# Altium project ТЕИЯ.464511.002 main.PrjPcb (part 1 of 3)
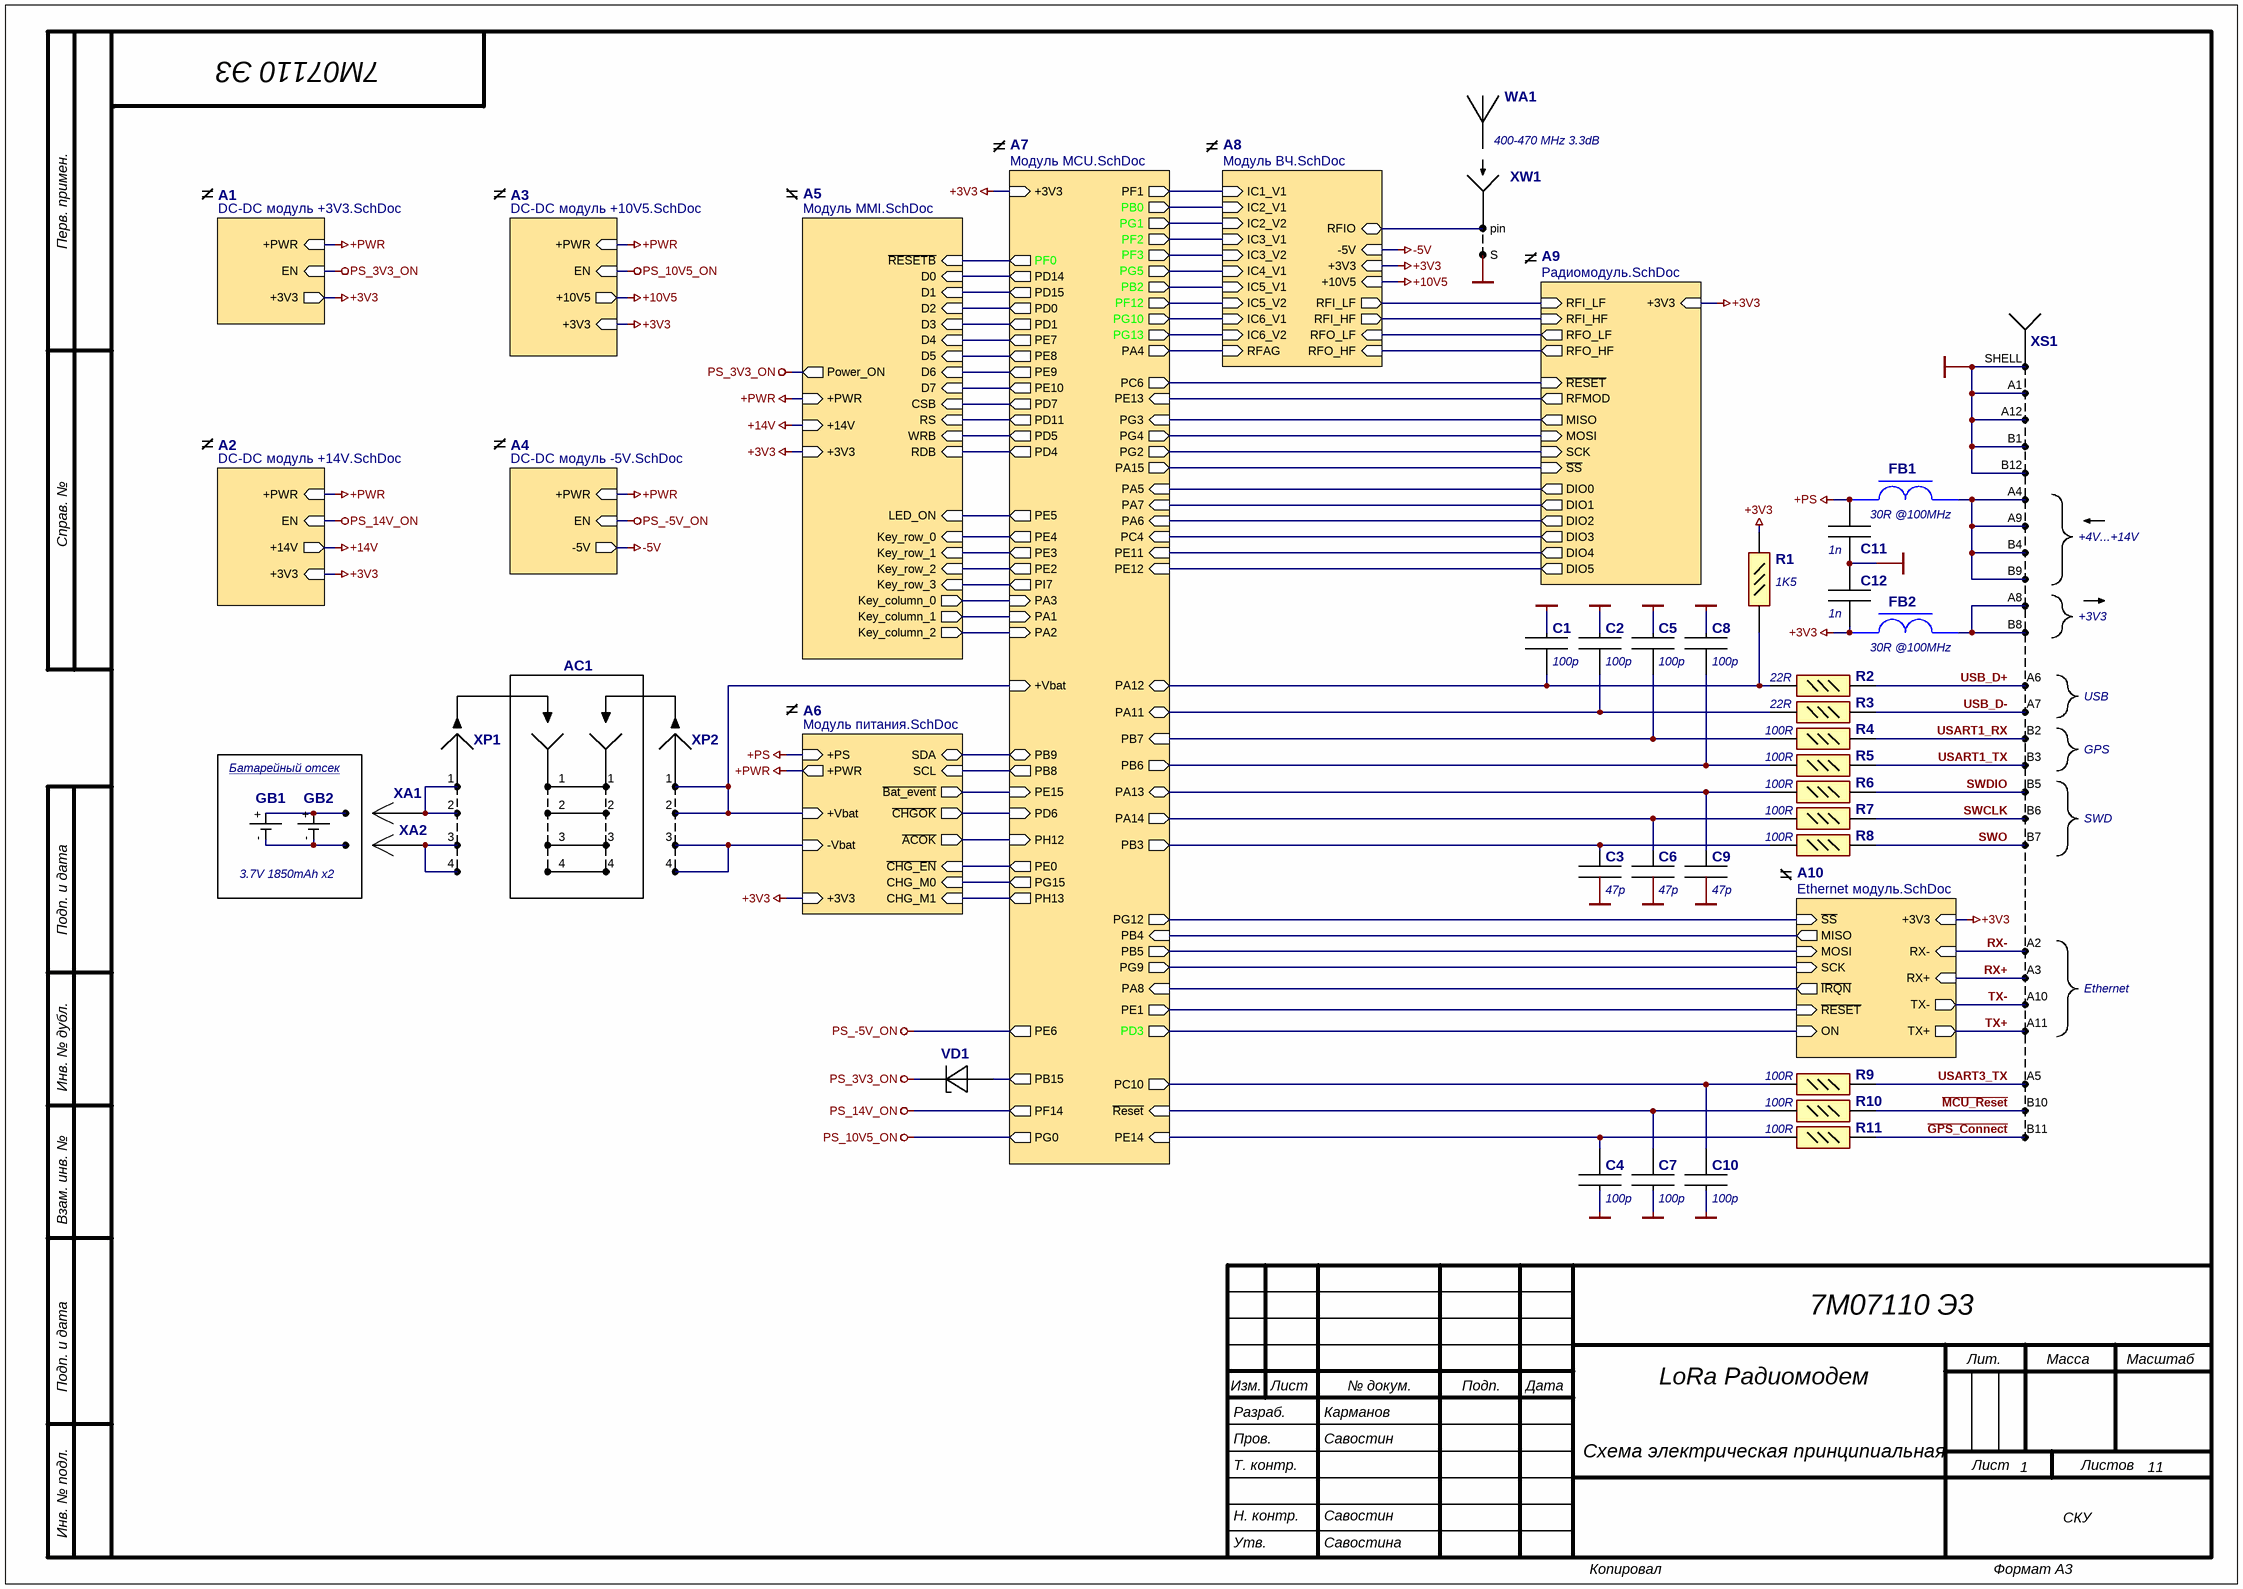
[diagram p0: 7М07110 Э3.SchDoc]
Компания: СКУ; Лист: #; Наименование: LoRa Радиомодем; Наименование1: LoRa Радиомодем; Нормоконтроль: Савостин; Обозначение: 7М07110 Э3; Проверил: Савостин; Разработал: Карманов; Тип документа: Схема электрическая принципиальная; Утвердил: Савостина
11 sheets, 437 parts. Net scope: hierarchical (ports join the sheet entries above them; power ports are global).
Board file: 7М07110.PcbDoc
Sheets:
  7М07110 Э3.SchDoc
    A1 = DC-DC модуль +3V3.SchDoc
    A2 = DC-DC модуль +14V.SchDoc
    A4 = DC-DC модуль -5V.SchDoc
    A10 = Ethernet модуль.SchDoc
    A7 = Модуль MCU.SchDoc
    A5 = Модуль MMI.SchDoc
    A9 = Радиомодуль.SchDoc
    A8 = Модуль ВЧ.SchDoc
    A6 = Модуль питания.SchDoc
    A3 = DC-DC модуль +10V5.SchDoc

## Sheet 7М07110 Э3.SchDoc
size 420 x 297 mm; DocumentNumber: 1; SheetNumber: 1; SheetTotal: 11; ListNumber: 1

### Parts
AC1  0151320401  (value not drawn)
C1  100p  [:CAP0402 100x50x50]
C2  100p  [:CAP0402 100x50x50]
C3  47p  [:CAP0402 100x50x50]
C4  100p  [:CAP0402 100x50x50]
C5  100p  [:CAP0402 100x50x50]
C6  47p  [:CAP0402 100x50x50]
C7  100p  [:CAP0402 100x50x50]
C8  100p  [:CAP0402 100x50x50]
C9  47p  [:CAP0402 100x50x50]
C10  100p  [:CAP0402 100x50x50]
C11  1n  [:CAP0402 100x50x50]
C12  1n  [:CAP0402 100x50x50]
FB1  30R @100MHz  [:FER BLM18SP300SN1D]
FB2  30R @100MHz  [:FER BLM18SP300SN1D]
GB1  3.7V 1850mAh  (value not drawn)
GB2  3.7V 1850mAh  (value not drawn)
R1  Manufacturer_Part_Number (part 2: value): 1K5  [:RES0402]  (hidden comment: RC0402FR-07)
R2  Manufacturer_Part_Number (part 2: value): 22R  [:RES0402]  (hidden comment: RC0402FR-07)
R3  Manufacturer_Part_Number (part 2: value): 22R  [:RES0402]  (hidden comment: RC0402FR-07)
R4  Manufacturer_Part_Number (part 2: value): 100R  [:RES0402]  (hidden comment: RC0402FR-07)
R5  Manufacturer_Part_Number (part 2: value): 100R  [:RES0402]  (hidden comment: RC0402FR-07)
R6  Manufacturer_Part_Number (part 2: value): 100R  [:RES0402]  (hidden comment: RC0402FR-07)
R7  Manufacturer_Part_Number (part 2: value): 100R  [:RES0402]  (hidden comment: RC0402FR-07)
R8  Manufacturer_Part_Number (part 2: value): 100R  [:RES0402]  (hidden comment: RC0402FR-07)
R9  Manufacturer_Part_Number (part 2: value): 100R  [:RES0402]  (hidden comment: RC0402FR-07)
R10  Manufacturer_Part_Number (part 2: value): 100R  [:RES0402]  (hidden comment: RC0402FR-07)
R11  Manufacturer_Part_Number (part 2: value): 100R  [:RES0402]  (hidden comment: RC0402FR-07)
VD1  30V 0.1A  [:DIODE SOD-923F]  (value not drawn)
WA1  Short Description: 400-470 MHz 3.3dB  (hidden comment: ANT-433-CW-QW-SMA-male)
X1  Big Circle Pad  (value not drawn)
X2  Big Circle Pad  (value not drawn)
XA1  0861-0-15-20-82-14-11-0  (value not drawn)
XA2  0861-0-15-20-82-14-11-0  (value not drawn)
XP1  5040500491  [:CON 5040500491]  (value not drawn)
XP2  5040500491  [:CON 5040500491]  (value not drawn)
XS1  UJ31-CH-3-MSMT-TR-67  [:CON TYPE-C UJ31-CH-3-MSMT-TR-67]  (value not drawn)
XW1  132371  [:CON 132371]  (value not drawn)

### Sub-sheets
A1 = DC-DC модуль +3V3.SchDoc: +3V3 (out), EN (in), +PWR (in)
A2 = DC-DC модуль +14V.SchDoc: +14V (out), EN (in), +PWR (in), +3V3 (in)
A3 = DC-DC модуль +10V5.SchDoc: +10V5 (out), EN (in), +PWR (in), +3V3 (in)
A4 = DC-DC модуль -5V.SchDoc: -5V (out), EN (in), +PWR (in)
A5 = Модуль MMI.SchDoc: D5 (in), D6 (in), D4 (in), D3 (in), CSB (in), RS (in), Key_column_2 (out), LED_ON (in), Power_ON (out), +PWR (in), Key_row_0 (in), Key_row_1 (in), Key_row_2 (in), Key_row_3 (in), Key_column_1 (out), D1 (in), D2 (in), D7 (in), RDB (in), WRB (in), ~{RESETB} (in), Key_column_0 (out), D0 (in), +14V (in), +3V3 (in)
A6 = Модуль питания.SchDoc: +Vbat (in), -Vbat (in), SDA (bidir), SCL (in), +PS (in), +PWR (out), ~{Bat_event} (out), ~{CHGOK} (out), ~{ACOK} (out), ~{CHG_EN} (in), CHG_M0 (in), CHG_M1 (in), +3V3 (in)
A7 = Модуль MCU.SchDoc: +3V3 (in), PF1 (out), PB0 (out), PC6 (out), PA5 (in), PE12 (in), PE11 (in), PA7 (in), PA6 (in), PC4 (in), PE13 (in), PA15 (out), PG2 (out), PG3 (in), PG4 (out), PG1 (out), PG10 (out), PG5 (out), PG13 (out), PB2 (out), PF12 (out), PF3 (out), PF2 (out), PA4 (out), PG12 (out), PB4 (in), PG9 (out), PB5 (out), PA8 (in), PE1 (out), PD3 (out), PE7 (out), PE10 (out), PD7 (out), PD11 (out), PD1 (out), PD5 (out), PE9 (out), PD14 (out), PD0 (out), PE8 (out), PD15 (out), PD4 (out), PE2 (out), PE3 (out), PI7 (out), PE5 (out), PF0 (out), PE4 (out), PA1 (in), PA3 (in), PA2 (in), PA12 (bidir), PA11 (bidir), PB6 (out), PB7 (in), PB3 (out), PA14 (out), PA13 (bidir), PC10 (out), PE14 (in), PE15 (in), PE6 (out), PG0 (out), PF14 (out), PB15 (out), PB9 (bidir), PB8 (out), PD6 (in), PH12 (in), PE0 (out), PG15 (out), PH13 (out), ~{Reset} (in), +Vbat (in)
A8 = Модуль ВЧ.SchDoc: -5V (in), +10V5 (in), IC6_V1 (in), IC4_V1 (in), IC5_V1 (in), IC6_V2 (in), IC2_V1 (in), IC5_V2 (in), IC3_V2 (in), IC3_V1 (in), IC2_V2 (in), RFAG (in), +3V3 (in), RFO_HF (in), RFI_LF (out), RFIO (bidir), RFI_HF (out), RFO_LF (in), IC1_V1 (in)
A9 = Радиомодуль.SchDoc: RFI_LF (in), RFI_HF (in), DIO3 (out), DIO4 (out), DIO5 (out), DIO2 (out), DIO0 (out), DIO1 (out), ~{RESET} (in), +3V3 (in), MISO (out), MOSI (in), RFMOD (out), SCK (in), ~{SS} (in), RFO_HF (out), RFO_LF (out)
A10 = Ethernet модуль.SchDoc: SCK (in), ~{SS} (in), +3V3 (in), ~{IRQN} (out), RX- (in), MISO (out), ON (in), RX+ (in), MOSI (in), TX- (out), ~{RESET} (in), TX+ (out)

### Nets
+3V3: C12.2 FB2.1 R1.2 ; sheet A1/+3V3, sheet A2/+3V3, sheet A10/+3V3, sheet A7/+3V3, sheet A5/+3V3, sheet A9/+3V3, sheet A8/+3V3, sheet A6/+3V3, sheet A3/+3V3
+10V5: sheet A8/+10V5, sheet A3/+10V5
+14V: sheet A2/+14V, sheet A5/+14V
+PS: C11.1 FB1.1 ; sheet A6/+PS
+PWR: sheet A1/+PWR, sheet A2/+PWR, sheet A4/+PWR, sheet A5/+PWR, sheet A6/+PWR, sheet A3/+PWR
-5V: sheet A4/-5V, sheet A8/-5V
GND: C1.2 C2.2 C3.2 C4.2 C5.2 C6.2 C7.2 C8.2 C9.2 C10.2 C11.2 C12.1 XS1.A1(GND_1) XS1.A12(GND_2) XS1.B1(GND_3) XS1.B12(GND_4) XS1.SHELL XW1.2(S)
PS_3V3_ON: VD1.1(K) ; sheet A1/EN, sheet A5/Power_ON
PS_10V5_ON: sheet A7/PG0, sheet A3/EN
PS_14V_ON: sheet A2/EN, sheet A7/PF14
PS_-5V_ON: sheet A4/EN, sheet A7/PE6
~{GPS_Connect}: R11.2 XS1.B11(SSRXP1)
~{MCU_Reset}: R10.2 XS1.B10(SSRXN1)
RX+: XS1.A3(SSTXN1) ; sheet A10/RX+
RX-: XS1.A2(SSTXP1) ; sheet A10/RX-
SWCLK: R7.2 XS1.B6(DP2)
SWDIO: R6.2 XS1.B5(CC2)
SWO: R8.2 XS1.B7(DN2)
TX+: XS1.A11(SSRXP2) ; sheet A10/TX+
TX-: XS1.A10(SSRXN2) ; sheet A10/TX-
USART1_RX: R4.2 XS1.B2(SSTXP2)
USART1_TX: R5.2 XS1.B3(SSTXN2)
USART3_TX: R9.2 XS1.A5(CC1)
USB_D+: R2.2 XS1.A6(DP1)
USB_D-: R3.2 XS1.A7(DN1)
NetC1_1: C1.1 R1.1 R2.1 ; sheet A7/PA12
NetC2_1: C2.1 R3.1 ; sheet A7/PA11
NetC3_1: C3.1 R8.1 ; sheet A7/PB3
NetC4_1: C4.1 R11.1 ; sheet A7/PE14
NetC5_1: C5.1 R4.1 ; sheet A7/PB7
NetC6_1: C6.1 R7.1 ; sheet A7/PA14
NetC7_1: C7.1 R10.1 ; sheet A7/~{Reset}
NetC8_1: C8.1 R5.1 ; sheet A7/PB6
NetC9_1: C9.1 R6.1 ; sheet A7/PA13
NetC10_1: C10.1 R9.1 ; sheet A7/PC10
NetC47_1: XP2.3 XP2.4 ; sheet A6/-Vbat
NetC88_1: sheet A9/RFO_HF, sheet A8/RFO_HF
NetC107_1: sheet A9/RFI_HF, sheet A8/RFI_HF
NetC162_1: sheet A9/RFI_LF, sheet A8/RFI_LF
NetC164_1: sheet A9/RFO_LF, sheet A8/RFO_LF
NetFB1_2: FB1.2 XS1.A4(VBUS_1) XS1.A9(VBUS_2) XS1.B4(VBUS_3) XS1.B9(VBUS_4)
NetFB2_2: FB2.2 XS1.A8(SBU1) XS1.B8(SBU2)
NetGB1_+: GB1.+(red) GB2.+(red) X1.1
NetGB1_-: GB1.-(black) GB2.-(black) X2.1
NetIC7_A4: sheet A7/PE0, sheet A6/~{CHG_EN}
NetIC7_A5: sheet A10/MISO, sheet A7/PB4
NetIC7_A9: sheet A7/PA15, sheet A9/~{SS}
NetIC7_B2: sheet A7/PI7, sheet A5/Key_row_3
NetIC7_B4: sheet A10/~{RESET}, sheet A7/PE1
NetIC7_B5: sheet A10/MOSI, sheet A7/PB5
NetIC7_B7: sheet A10/SCK, sheet A7/PG9
NetIC7_B8: sheet A7/PD0, sheet A5/D2
NetIC7_B13: sheet A7/PH12, sheet A6/~{ACOK}
NetIC7_C4: sheet A7/PB8, sheet A6/SCL
NetIC7_C6: sheet A7/PG15, sheet A6/CHG_M0
NetIC7_C7: sheet A7/PD4, sheet A5/RDB
NetIC7_C8: sheet A7/PD1, sheet A5/D3
NetIC7_C9: sheet A7/PH13, sheet A6/CHG_M1
NetIC7_D1: sheet A7/PE4, sheet A5/Key_row_0
NetIC7_D2: sheet A7/PE3, sheet A5/Key_row_1
NetIC7_D3: sheet A7/PE2, sheet A5/Key_row_2
NetIC7_D4: sheet A7/PB9, sheet A6/SDA
NetIC7_D6: sheet A7/PG10, sheet A8/IC6_V1
NetIC7_D7: sheet A7/PD5, sheet A5/WRB
NetIC7_E4: sheet A7/PE5, sheet A5/LED_ON
NetIC7_E7: sheet A7/PD6, sheet A6/~{CHGOK}
NetIC7_E8: sheet A10/ON, sheet A7/PD3
NetIC7_E11: sheet A10/~{IRQN}, sheet A7/PA8
NetIC7_F3: sheet A7/PF2, sheet A8/IC3_V1
NetIC7_F4: sheet A7/PF1, sheet A8/IC1_V1
NetIC7_F5: sheet A7/PF0, sheet A5/~{RESETB}
NetIC7_F6: sheet A10/~{SS}, sheet A7/PG12
NetIC7_F7: sheet A7/PD7, sheet A5/CSB
NetIC7_F11: sheet A7/PC6, sheet A9/~{RESET}
NetIC7_G3: sheet A7/PF3, sheet A8/IC3_V2
NetIC7_G6: sheet A7/PG13, sheet A8/IC6_V2
NetIC7_G7: sheet A7/PG4, sheet A9/MOSI
NetIC7_G8: sheet A7/PG3, sheet A9/MISO
NetIC7_G9: sheet A7/PG5, sheet A8/IC4_V1
NetIC7_H5: sheet A7/PG1, sheet A8/IC2_V2
NetIC7_H6: sheet A7/PE10, sheet A5/D7
NetIC7_H9: sheet A7/PG2, sheet A9/SCK
NetIC7_H10: sheet A7/PD15, sheet A5/D1
NetIC7_H11: sheet A7/PD14, sheet A5/D0
NetIC7_J6: sheet A7/PE9, sheet A5/D6
NetIC7_J7: sheet A7/PE15, sheet A6/~{Bat_event}
NetIC7_J9: sheet A7/PD11, sheet A5/RS
NetIC7_K4: sheet A7/PC4, sheet A9/DIO3
NetIC7_K6: sheet A7/PE8, sheet A5/D5
NetIC7_L3: sheet A7/PA5, sheet A9/DIO0
NetIC7_L4: sheet A7/PA6, sheet A9/DIO2
NetIC7_L7: sheet A7/PE7, sheet A5/D4
NetIC7_L8: sheet A7/PE13, sheet A9/RFMOD
NetIC7_L10: VD1.2(A) ; sheet A7/PB15
NetIC7_M1: sheet A7/PA1, sheet A5/Key_column_1
NetIC7_M2: sheet A7/PA3, sheet A5/Key_column_0
NetIC7_M4: sheet A7/PA7, sheet A9/DIO1
NetIC7_M8: sheet A7/PE12, sheet A9/DIO5
NetIC7_N1: sheet A7/PA2, sheet A5/Key_column_2
NetIC7_N2: sheet A7/PA4, sheet A8/RFAG
NetIC7_N4: sheet A7/PB0, sheet A8/IC2_V1
NetIC7_N5: sheet A7/PB2, sheet A8/IC5_V1
NetIC7_N6: sheet A7/PF12, sheet A8/IC5_V2
NetIC7_N8: sheet A7/PE11, sheet A9/DIO4
NetIC13_11: XW1.1(pin) ; sheet A8/RFIO
NetR50_1: XP2.1 XP2.2 ; sheet A7/+Vbat, sheet A6/+Vbat
NetXA1_1: XA1.1 XP1.1 XP1.2
NetXA2_1: XA2.1 XP1.3 XP1.4

Not connected (* = marked no-connect by the designer): AC1 1 2 3 4

### Notes on the sheet
- (near XS1) +4V...+14V
- (near XS1) +3V3
- USB
- Батарейный отсек
- (near AC1) 1
- GPS
- (near AC1) 2
- (near AC1) 3
- (near AC1) 4
- SWD
- 3.7V 1850mAh х2
- Ethernet
- Перв. примен.
- Справ. №
- Подп. и дата
- Инв. № дубл.
- Взам. инв. №
- Изм.
- Лист
- № докум.
- Подп.
- Дата
- Лит.
- Масса
- Масштаб
- Разраб.
- Пров.
- Т. контр.
- Листов
- Инв. № подл.
- Н. контр.
- Утв.
- Копировал
- Формат А3

### Library data of the parts
AC1 = 0151320401: Cable-Assy Picolock 1.5mm Pitch 4 Wire 24AWG 100mm; Manufacturer_Name: Molex; Manufacturer_Part_Number: 0151320401; Short Description: 4 Wire 24AWG
C1 C2 C4 C5 C7 C8 C10 = GCM1555C1H101JA16D: CAP CER  50V C0G/NP0 0402; Manufacturer_Name: Murata Electronics; Short Description: 0402 100p 50V; Manufacturer_Part_Number: GCM1555C1H101JA16D
C3 C6 C9 = GJM1555C1H470GB01D: CAP CER  50V C0G/NP0 0402; Manufacturer_Name: Murata Electronics; Short Description: 0402 47p 50V; Manufacturer_Part_Number: GJM1555C1H470GB01D
C11 C12 = GRM1555C1H102JA01J: ±5% 50V Ceramic Capacitor C0G, NP0 0402 (1005 Metric); Manufacturer_Name: Murata Electronics; Short Description: 0402 1n 50V; Height: 0.55mm; Manufacturer_Part_Number: GRM1555C1H102JA01J
FB1 FB2 = BLM18SP300SN1D: 30 Ohms @ 100MHz 1 Power Line Ferrite Bead 0603 (1608 Metric) 6A 8mOhm; Manufacturer_Name: Murata Electronics; Short Description: 0603 30R @100MHz; Datasheet Link: http://www.murata.com/~/media/webrenewal/support/library/catalog/products/emc/emifil/c31e.ashx?la=en-gb; Height: 0.95mm; Manufacturer_Part_Number: BLM18SP300SN1D; Mouser Part Number: 81-BLM18SP300SN1D; Mouser Price/Stock: https://www.mouser.co.uk/ProductDetail/Murata-Electronics/BLM18SP300SN1D/?qs=W%2FMpXkg%252BdQ4o%252BOP%252B6m8FYA%3D%3D
GB1 GB2 = LP-1850-103450UN: Battery Li-po 3.7V 1850mAh 10х34х50; Manufacturer_Name: ROBITON; Short Description: Li-pol  1850мАч; Manufacturer_Part_Number: LP-1850-103450UN
R1-R11 = RC0402FR-07: Resistor 0402 1% 1/16W / Value Range: 1Ω ... 10 MΩ / Value Example: / 0R = 0Ω / 97R6 = 97.6Ω / 9K76 = 9760Ω / 1M = 1,000,000Ω; Manufacturer_Name: YAGEO; Manufacturer_Part_Number (part 3: after value): L; Short Description: 0402 1%; Datasheet Link: http://www.yageo.com/documents/recent/PYu-RC0402_51_RoHS_L_6_r.pdf; Height: 0.4mm; Manufacturer_Part_Number: RC0402FR-07; Parameter 1: *
VD1 = CDBQR0130R: Diodes Schottky 0402 30V 0.1A; Manufacturer_Name: Comchip Technology; Datasheet Link: http://www.comchiptech.com/admin/files/product/CDBQR0130R-HF-RevC796140.pdf; Height: 0.55mm; Manufacturer_Part_Number: CDBQR0130R; Mouser Part Number: 750-CDBQR0130R; Mouser Price/Stock: https://www.mouser.co.uk/ProductDetail/Comchip-Technology/CDBQR0130R?qs=tw%252BuQ%2FB6PO3SSBtQ52w%2FCg%3D%3D; Arrow Part Number: CDBQR0130R; Arrow Price/Stock: https://www.arrow.com/en/products/cdbqr0130r/comchip-technology; Short Description: 0402 30V 0.1A
WA1 = ANT-433-CW-QW-SMA-male: Antenna 400-470MHz 3.3dB SMA male; Manufacturer_Name: AntennaFactor by Linx; Manufacturer_Part_Number: ANT-433-CW-QW-SMA-male
X1 X2 = Big Circle Pad: Большая круглая контактная площадка
XA1 XA2 = 0861-0-15-20-82-14-11-0: Контакт пружинный 9A 10mm; Manufacturer_Name: MILL-MAX; Short Description: 9A 10mm; Manufacturer_Part_Number: 0861-0-15-20-82-14-11-0
XP1 XP2 = 5040500491: Picolock 1.5mm Pitch Male 4-pin; Manufacturer_Name: Molex; Short Description: 1.5mm 4-pin; Manufacturer_Part_Number: 5040500491
XS1 = UJ31-CH-3-MSMT-TR-67: type C IP67 with ruber O ring; Manufacturer_Name: CUI Devices; Manufacturer_Part_Number: UJ31-CH-3-MSMT-TR-67; Short Description: type C IP67
XW1 = 132371: RF SMA Connectors 50Ohm; Manufacturer_Name: Amphenol; Short Description: SMA 50Ohm; Manufacturer_Part_Number: 132371

## Sheet DC-DC модуль +3V3.SchDoc
size 209 x 297 mm; DocumentNumber: 2; SheetNumber: 2; SheetTotal: 11; ListNumber: 1
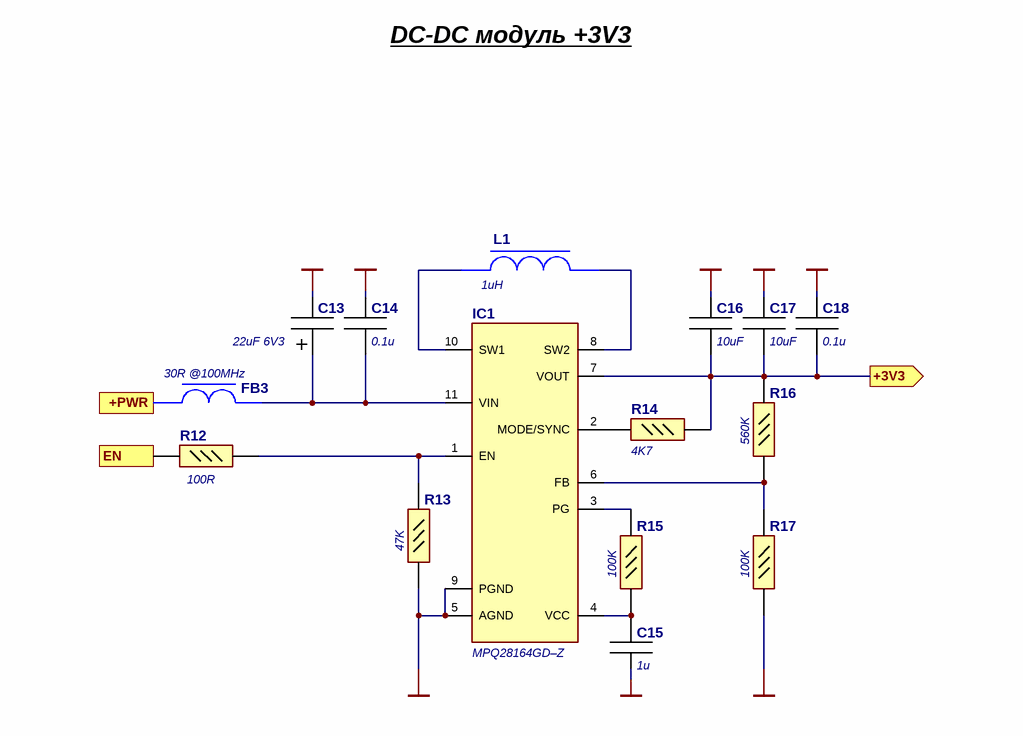
[diagram p1: DC-DC модуль +3V3.SchDoc]

### Parts
C13  22uF 6V3  [:CAP1206 C3216-18]
C14  0.1u  [:CAP0402 100x50x50]
C15  1u  [:CAP0603 C1608х08]
C16  10uF  [:CAP0805 C2012X125]
C17  10uF  [:CAP0805 C2012X125]
C18  0.1u  [:CAP0402 100x50x50]
FB3  30R @100MHz  [:FER BLM18SP300SN1D]
IC1  MPQ28164GD–Z  [:QFN11 P300X200X100-11N]
L1  1uH  [:IND1210 C3225]
R12  Manufacturer_Part_Number (part 2: value): 100R  [:RES0402]  (hidden comment: RC0402FR-07)
R13  Manufacturer_Part_Number (part 2: value): 47K  [:RES0402]  (hidden comment: RC0402FR-07)
R14  Manufacturer_Part_Number (part 2: value): 4K7  [:RES0402]  (hidden comment: RC0402FR-07)
R15  Manufacturer_Part_Number (part 2: value): 100K  [:RES0402]  (hidden comment: RC0402FR-07)
R16  Manufacturer_Part_Number (part 2: value): 560K  [:RES0402]  (hidden comment: RC0402FR-07)
R17  Manufacturer_Part_Number (part 2: value): 100K  [:RES0402]  (hidden comment: RC0402FR-07)

### Ports
+3V3 (out), +PWR (in), EN (in)

### Nets
+3V3: C16.1 C17.1 C18.2 IC1.7(VOUT) R14.2 R16.2 ; port +3V3
+PWR: FB3.1 ; port +PWR
GND: C13.2 C14.1 C15.1 C16.2 C17.2 C18.1 IC1.5(AGND) IC1.9(PGND) R13.1 R17.1
PS_3V3_ON: R12.1 ; port EN
NetC13_1: C13.1(+) C14.2 FB3.2 IC1.11(VIN)
NetC15_2: C15.2 IC1.4(VCC) R15.1
NetIC1_1: IC1.1(EN) R12.2 R13.2
NetIC1_2: IC1.2(MODE/SYNC) R14.1
NetIC1_3: IC1.3(PG) R15.2
NetIC1_6: IC1.6(FB) R16.1 R17.2
NetIC1_8: IC1.8(SW2) L1.2
NetIC1_10: IC1.10(SW1) L1.1

### Notes on the sheet
- DC-DC модуль +3V3
- Подп. и дата
- Инв. № дубл.
- Взам. инв. №
- Инв. № подл.
- Лист
- Изм.
- № докум.
- Подп.
- Дата
- Копировал
- Формат А4

### Library data of the parts
C13 = TPSA226K006R0300: 22uF Molded Tantalum Capacitors 6.3V 1206 (3216 Metric) 300mOhm @ 100kHz; Manufacturer_Name: AVX; Short Description: 1206 22uF 6V3; Manufacturer_Part_Number: TPSA226K006R0300
C14 C18 = GRM155R71E104KE14J: ±10% 25V Ceramic Capacitor X7R 0402 (1005 Metric); Manufacturer_Name: Murata Electronics; Short Description: 0402 0.1uF 25V; Datasheet Link: http://www.murata.com/~/media/webrenewal/support/library/catalog/products/capacitor/mlcc/c02e.pdf; Height: 0.55mm; Manufacturer_Part_Number: GRM155R71E104KE14J; Mouser Part Number: 81-GRM155R71E104KE4J; Mouser Price/Stock: https://www.mouser.co.uk/ProductDetail/Murata-Electronics/GRM155R71E104KE14J?qs=hNud%2FORuBR2EQtvG2InwAQ%3D%3D; Arrow Part Number: GRM155R71E104KE14J; Arrow Price/Stock: https://www.arrow.com/en/products/grm155r71e104ke14j/murata-manufacturing
C15 = GCM188R71E105KA64D: ±10% 25V Ceramic Capacitor X7R 0603 (1608 Metric); Manufacturer_Name: Murata Electronics; Short Description: 0603 1u 25V; Height: 0.9mm; Manufacturer_Part_Number: GCM188R71E105KA64D
C16 C17 = C2012X5R1C106M085AC: CAP CER 10uF 16V X5R 0805; Manufacturer_Name: TDK; Short Description: 0805 10uF 16V; Datasheet Link: https://product.tdk.com/info/en/documents/chara_sheet/C2012X5R1C106M085AC.pdf; Height: 1.45mm; Manufacturer_Part_Number: C2012X5R1C106M085AC; Mouser Part Number: 810-C2012X5R1C106M-2; Mouser Price/Stock: https://www.mouser.co.uk/ProductDetail/TDK/C2012X5R1C106M085AC?qs=LcTL%2F5vFEzFm8m4UBfhWvw%3D%3D; Arrow Part Number: C2012X5R1C106M085AC; Arrow Price/Stock: https://www.arrow.com/en/products/c2012x5r1c106m085ac/tdk
FB3 = BLM18SP300SN1D: as FB1 on sheet 7М07110 Э3; Datasheet Link: http://www.murata.com/~/media/webrenewal/support/library/catalog/products/emc/emifil/c31e.ashx?la=en-gb; Height: 0.95mm; Manufacturer_Part_Number: BLM18SP300SN1D; Mouser Part Number: 81-BLM18SP300SN1D; Mouser Price/Stock: https://www.mouser.co.uk/ProductDetail/Murata-Electronics/BLM18SP300SN1D/?qs=W%2FMpXkg%252BdQ4o%252BOP%252B6m8FYA%3D%3D
IC1 = MPQ28164GD–Z: DC/DC Converter / 1.2V to 5.5V Input / 1.5V to 5V Output 2A; Manufacturer_Name: Monolithic Power Systems (MPS); Short Description: 1.5...5V; Datasheet Link: https://componentsearchengine.com/Datasheets/1/MP28164GD-P.pdf; Height: 1mm; Manufacturer_Part_Number: MPQ28164GD–Z; Mouser Price/Stock: https://www.mouser.co.uk/ProductDetail/Monolithic-Power-Systems-MPS/MP28164GD-P/?qs=BHWkRorfSmXVYcyyqwr4xg%3D%3D
L1 = 74479299210: 1uH Shielded Molded Inductor 3A 46mOhm Max 1210 (3225 Metric) / Current - Saturation (Isat) 5.2A / Current Rating (Amps) 3A / Frequency - Self Resonant 50MHz; Manufacturer_Name: Würth Elektronik; Short Description: 1uH 3A 46mOhm; Manufacturer_Part_Number: 74479299210
R12-R17 = RC0402FR-07: as R1 on sheet 7М07110 Э3; Datasheet Link: http://www.yageo.com/documents/recent/PYu-RC0402_51_RoHS_L_6_r.pdf; Height: 0.4mm; Manufacturer_Part_Number: RC0402FR-07; Parameter 1: *

## Sheet DC-DC модуль +14V.SchDoc
size 209 x 297 mm; DocumentNumber: 3; SheetNumber: 3; SheetTotal: 11; ListNumber: 1
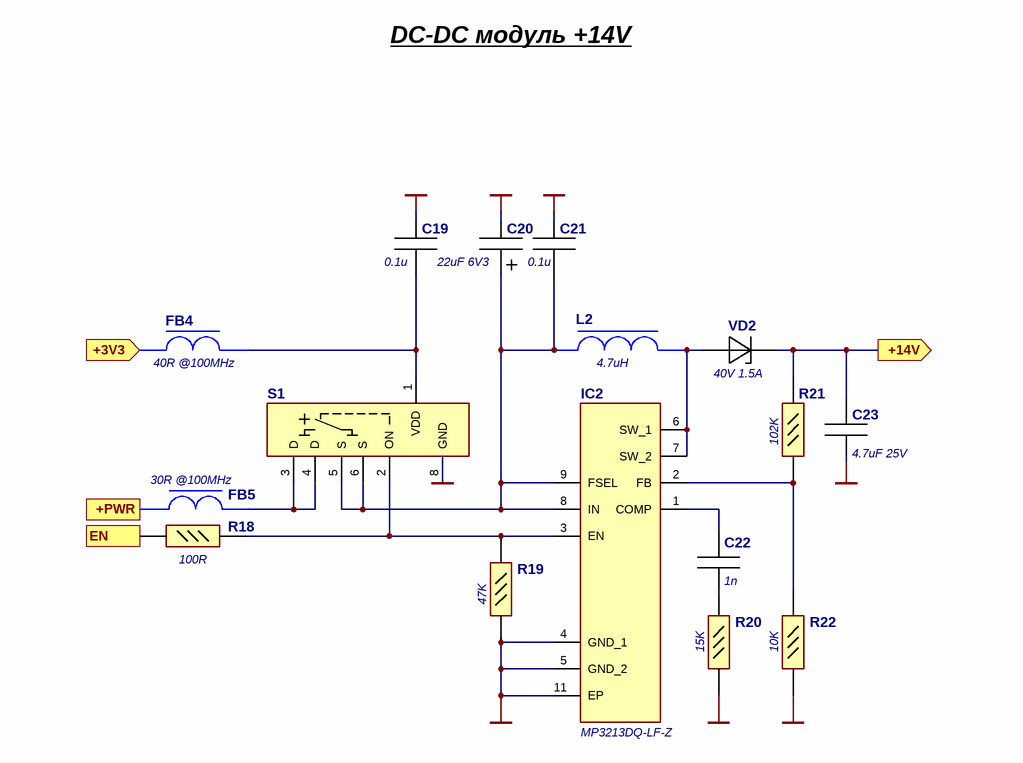
[diagram p2: DC-DC модуль +14V.SchDoc]

### Parts
C19  0.1u  [:CAP0402 100x50x50]
C20  22uF 6V3  [:CAP1206 C3216-18]
C21  0.1u  [:CAP0402 100x50x50]
C22  1n  [:CAP0402 100x50x50]
C23  4.7uF 25V  [:CAP0805 C2012X125]
FB4  40R @100MHz  [:FER MMZ1005Y400CTD25]
FB5  30R @100MHz  [:FER BLM18SP300SN1D]
IC2  MP3213DQ-LF-Z  [:QFN10 P300X300X100-11N-D]
L2  4.7uH  [:IND1210 C3225]
R18  Manufacturer_Part_Number (part 2: value): 100R  [:RES0402]  (hidden comment: RC0402FR-07)
R19  Manufacturer_Part_Number (part 2: value): 47K  [:RES0402]  (hidden comment: RC0402FR-07)
R20  Manufacturer_Part_Number (part 2: value): 15K  [:RES0402]  (hidden comment: RC0402FR-07)
R21  Manufacturer_Part_Number (part 2: value): 102K  [:RES0402]  (hidden comment: RC0402FR-07)
R22  Manufacturer_Part_Number (part 2: value): 10K  [:RES0402]  (hidden comment: RC0402FR-07)
S1  4A 7.8mOhm  [:TRAN SLG59M309V]  (value not drawn)
VD2  40V 1.5A  [:DIODE CST2C]

### Ports
+3V3 (in), +14V (out), +PWR (in), EN (in)

### Nets
+3V3: FB4.2 ; port +3V3
+14V: C23.2 R21.2 VD2.1(K) ; port +14V
+PWR: FB5.1 ; port +PWR
GND: C19.1 C20.2 C21.1 C23.1 IC2.4(GND_1) IC2.5(GND_2) IC2.11(EP) R19.1 R20.1 R22.1 S1.8(GND)
PS_14V_ON: R18.1 ; port EN
NetC19_2: C19.2 FB4.1 S1.1(VDD)
NetC20_1: C20.1(+) C21.2 IC2.8(IN) IC2.9(FSEL) L2.1 S1.5(S) S1.6(S)
NetC22_1: C22.1 R20.2
NetC22_2: C22.2 IC2.1(COMP)
NetFB5_2: FB5.2 S1.3(D) S1.4(D)
NetIC2_2: IC2.2(FB) R21.1 R22.2
NetIC2_3: IC2.3(EN) R18.2 R19.2 S1.2(ON)
NetIC2_6: IC2.6(SW_1) IC2.7(SW_2) L2.2 VD2.2(A)

### Notes on the sheet
- DC-DC модуль +14V
- Подп. и дата
- Инв. № дубл.
- Взам. инв. №
- Инв. № подл.
- Лист
- Изм.
- № докум.
- Подп.
- Дата
- Копировал
- Формат А4

### Library data of the parts
C19 C21 = GRM155R71E104KE14J: as C14 on sheet DC-DC модуль +3V3; Datasheet Link: http://www.murata.com/~/media/webrenewal/support/library/catalog/products/capacitor/mlcc/c02e.pdf; Height: 0.55mm; Manufacturer_Part_Number: GRM155R71E104KE14J; Mouser Part Number: 81-GRM155R71E104KE4J; Mouser Price/Stock: https://www.mouser.co.uk/ProductDetail/Murata-Electronics/GRM155R71E104KE14J?qs=hNud%2FORuBR2EQtvG2InwAQ%3D%3D; Arrow Part Number: GRM155R71E104KE14J; Arrow Price/Stock: https://www.arrow.com/en/products/grm155r71e104ke14j/murata-manufacturing
C20 = TPSA226K006R0300: as C13 on sheet DC-DC модуль +3V3; Manufacturer_Part_Number: TPSA226K006R0300
C22 = GRM1555C1H102JA01J: as C11 on sheet 7М07110 Э3; Height: 0.55mm; Manufacturer_Part_Number: GRM1555C1H102JA01J
C23 = GRM21BZ71E475KE15L: CAP CER 4.7uF 25V X7R 0805; Manufacturer_Name: Murata Electronics; Short Description: 0805 4.7uF 25V; Datasheet Link: https://search.murata.co.jp/Ceramy/image/img/A01X/G101/ENG/GRM21BZ71E475KE15-01.pdf; Height: 1.45mm; Manufacturer_Part_Number: GRM21BZ71E475KE15L
FB4 = MMZ1005Y400CTD25: 40 Ohms @ 100MHz 1 Signal Line Ferrite Bead 0402 (1005 Metric) 550mA 100mOhm; Manufacturer_Name: TDK; Short Description: 0402 40R @100MHz; Datasheet Link: https://www.arrow.com/en/products/mmz1005y400ctd25/tdk; Height: 0.55mm; Manufacturer_Part_Number: MMZ1005Y400CTD25; Mouser Part Number: 810-MMZ1005Y400CTD25; Mouser Price/Stock: https://www.mouser.com/Search/Refine.aspx?Keyword=810-MMZ1005Y400CTD25; Arrow Part Number: MMZ1005Y400CTD25; Arrow Price/Stock: https://www.arrow.com/en/products/mmz1005y400ctd25/tdk
FB5 = BLM18SP300SN1D: as FB1 on sheet 7М07110 Э3; Datasheet Link: http://www.murata.com/~/media/webrenewal/support/library/catalog/products/emc/emifil/c31e.ashx?la=en-gb; Height: 0.95mm; Manufacturer_Part_Number: BLM18SP300SN1D; Mouser Part Number: 81-BLM18SP300SN1D; Mouser Price/Stock: https://www.mouser.co.uk/ProductDetail/Murata-Electronics/BLM18SP300SN1D/?qs=W%2FMpXkg%252BdQ4o%252BOP%252B6m8FYA%3D%3D
IC2 = MP3213DQ-LF-Z: DC/DC Converter / 3...22V 3.5A; Manufacturer_Name: Monolithic Power Systems (MPS); Datasheet Link: https://www.monolithicpower.com/en/documentview/productdocument/index/version/2/document_type/Datasheet/lang/en/sku/MP3213/document_id/1111; Height: 1mm; Manufacturer_Part_Number: MP3213DQ-LF-Z; Mouser Part Number: 946-MP3213DQLFZ; Mouser Price/Stock: https://www.mouser.co.uk/ProductDetail/Monolithic-Power-Systems-MPS/MP3213DQ-LF-Z?qs=rC7bBWoQAAkNszTDCx8XYw%3D%3D; Short Description: 3...22V
L2 = CBC3225T4R7MR: 4.7µH Unshielded Wirewound Inductor 1.01A 130mOhm Max 1210 (3225 Metric) / Current - Saturation (Isat) 1.25A / Current Rating (Amps) 1.01A / Frequency - Self Resonant 70MHz; Manufacturer_Name: Taiyo Yuden; Short Description: 4.7uH 1A 130mOhm; Manufacturer_Part_Number: CBC3225T4R7MR
R18-R22 = RC0402FR-07: as R1 on sheet 7М07110 Э3; Datasheet Link: http://www.yageo.com/documents/recent/PYu-RC0402_51_RoHS_L_6_r.pdf; Height: 0.4mm; Manufacturer_Part_Number: RC0402FR-07; Parameter 1: *
S1 = SLG59M309V: Power Switch/Driver 1:1 N-Channel 4A  7.8mOhm 8-FC-TDFN (1.5x2); Manufacturer_Name: Dialog Semiconductor GmbH; Manufacturer_Part_Number: SLG59M309V
VD2 = CCS15S40,L3F: Diode Schottky 40V 1.5A / @If 550mV @ 1.5A / @Vr 200µA @ 40V; Manufacturer_Name: Toshiba; Short Description: 0603 40V 1.5A; Manufacturer_Part_Number: CCS15S40,L3F

## Sheet DC-DC модуль -5V.SchDoc
size 209 x 297 mm; DocumentNumber: 5; SheetNumber: 5; SheetTotal: 11; ListNumber: 1
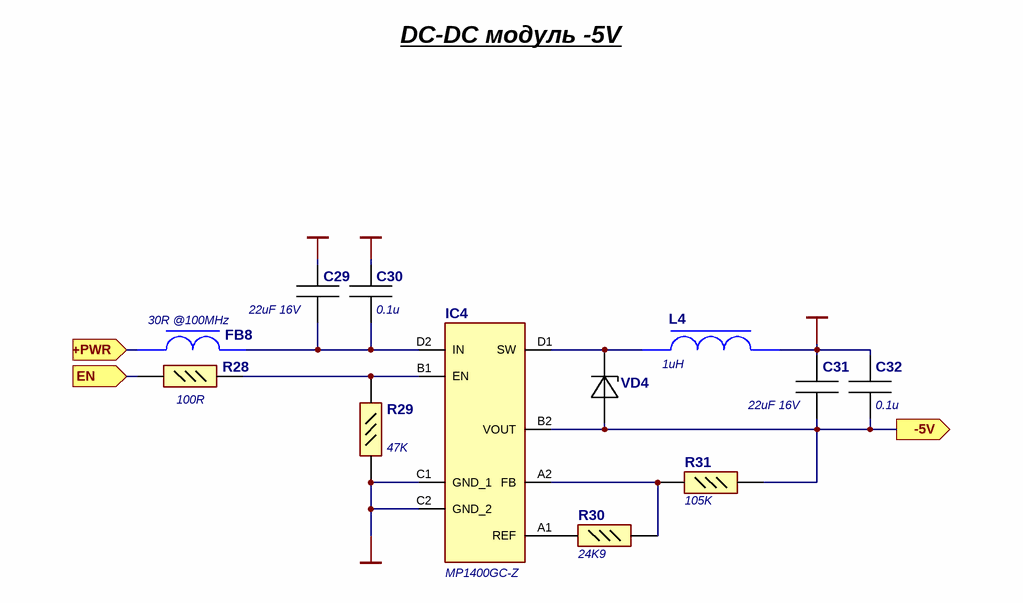
[diagram p3: DC-DC модуль -5V.SchDoc]

### Parts
C29  22uF 16V  [:CAP0805 C2012X125]
C30  0.1u  [:CAP0402 100x50x50]
C31  22uF 16V  [:CAP0805 C2012X125]
C32  0.1u  [:CAP0402 100x50x50]
FB8  30R @100MHz  [:FER BLM18SP300SN1D]
IC4  MP1400GC-Z  [:BGA8 CSP P2X4_80X160X63]
L4  1uH  [:IND1210 C3225]
R28  Manufacturer_Part_Number (part 2: value): 100R  [:RES0402]  (hidden comment: RC0402FR-07)
R29  Manufacturer_Part_Number (part 2: value): 47K  [:RES0402]  (hidden comment: RC0402FR-07)
R30  Manufacturer_Part_Number (part 2: value): 24K9  [:RES0402]  (hidden comment: RC0402FR-07)
R31  Manufacturer_Part_Number (part 2: value): 105K  [:RES0402]  (hidden comment: RC0402FR-07)
VD4  40V 1.5A  [:DIODE CST2C]  (value not drawn)

### Ports
+PWR (in), -5V (out), EN (in)

### Nets
+PWR: FB8.1 ; port +PWR
-5V: C31.1 C32.2 IC4.B2(VOUT) R31.2 VD4.2(A) ; port -5V
GND: C29.2 C30.1 C31.2 C32.1 IC4.C1(GND_1) IC4.C2(GND_2) L4.2 R29.1
PS_-5V_ON: R28.1 ; port EN
NetC29_1: C29.1 C30.2 FB8.2 IC4.D2(IN)
NetIC4_A1: IC4.A1(REF) R30.1
NetIC4_A2: IC4.A2(FB) R30.2 R31.1
NetIC4_B1: IC4.B1(EN) R28.2 R29.2
NetIC4_D1: IC4.D1(SW) L4.1 VD4.1(K)

### Notes on the sheet
- DC-DC модуль -5V
- Подп. и дата
- Инв. № дубл.
- Взам. инв. №
- Инв. № подл.
- Лист
- Изм.
- № докум.
- Подп.
- Дата
- Копировал
- Формат А4

### Library data of the parts
C29 C31 = GRM21BR61C226ME44L: CAP CER 22uF 16V X5R; Manufacturer_Name: Murata Electronics; Short Description: 0805 22uF 16V; Datasheet Link: https://psearch.en.murata.com/capacitor/product/GRM21BR61C226ME44%23.html; Height: 1.45mm; Manufacturer_Part_Number: GRM21BR61C226ME44L; Mouser Part Number: 81-GRM21BR61C226ME4L; Mouser Price/Stock: https://www.mouser.co.uk/ProductDetail/Murata-Electronics/GRM21BR61C226ME44L?qs=H45D%252BQBid9ZSEksDj3jAIw%3D%3D; Arrow Part Number: GRM21BR61C226ME44L; Arrow Price/Stock: https://www.arrow.com/en/products/grm21br61c226me44l/murata-manufacturing
C30 C32 = GRM155R71E104KE14J: as C14 on sheet DC-DC модуль +3V3; Datasheet Link: http://www.murata.com/~/media/webrenewal/support/library/catalog/products/capacitor/mlcc/c02e.pdf; Height: 0.55mm; Manufacturer_Part_Number: GRM155R71E104KE14J; Mouser Part Number: 81-GRM155R71E104KE4J; Mouser Price/Stock: https://www.mouser.co.uk/ProductDetail/Murata-Electronics/GRM155R71E104KE14J?qs=hNud%2FORuBR2EQtvG2InwAQ%3D%3D; Arrow Part Number: GRM155R71E104KE14J; Arrow Price/Stock: https://www.arrow.com/en/products/grm155r71e104ke14j/murata-manufacturing
FB8 = BLM18SP300SN1D: as FB1 on sheet 7М07110 Э3; Datasheet Link: http://www.murata.com/~/media/webrenewal/support/library/catalog/products/emc/emifil/c31e.ashx?la=en-gb; Height: 0.95mm; Manufacturer_Part_Number: BLM18SP300SN1D; Mouser Part Number: 81-BLM18SP300SN1D; Mouser Price/Stock: https://www.mouser.co.uk/ProductDetail/Murata-Electronics/BLM18SP300SN1D/?qs=W%2FMpXkg%252BdQ4o%252BOP%252B6m8FYA%3D%3D
IC4 = MP1400GC-Z: DC/DC Converter / Input 2.7V...7V / Output -0.9V...-6V 600mA; Manufacturer_Name: Monolithic Power Systems (MPS); Short Description: -0.9...-6V; Datasheet Link: https://www.mouser.co.uk/datasheet/2/277/MP1400-1384079.pdf; Height: 0.63mm; Manufacturer_Part_Number: MP1400GC-Z
L4 = 74479299210: as L1 on sheet DC-DC модуль +3V3; Manufacturer_Part_Number: 74479299210
R28-R31 = RC0402FR-07: as R1 on sheet 7М07110 Э3; Datasheet Link: http://www.yageo.com/documents/recent/PYu-RC0402_51_RoHS_L_6_r.pdf; Height: 0.4mm; Manufacturer_Part_Number: RC0402FR-07; Parameter 1: *
VD4 = CCS15S40,L3F: as VD2 on sheet DC-DC модуль +14V; Manufacturer_Part_Number: CCS15S40,L3F

## Sheet Ethernet модуль.SchDoc
size 209 x 297 mm; DocumentNumber: 11; SheetNumber: 11; SheetTotal: 11; ListNumber: 1
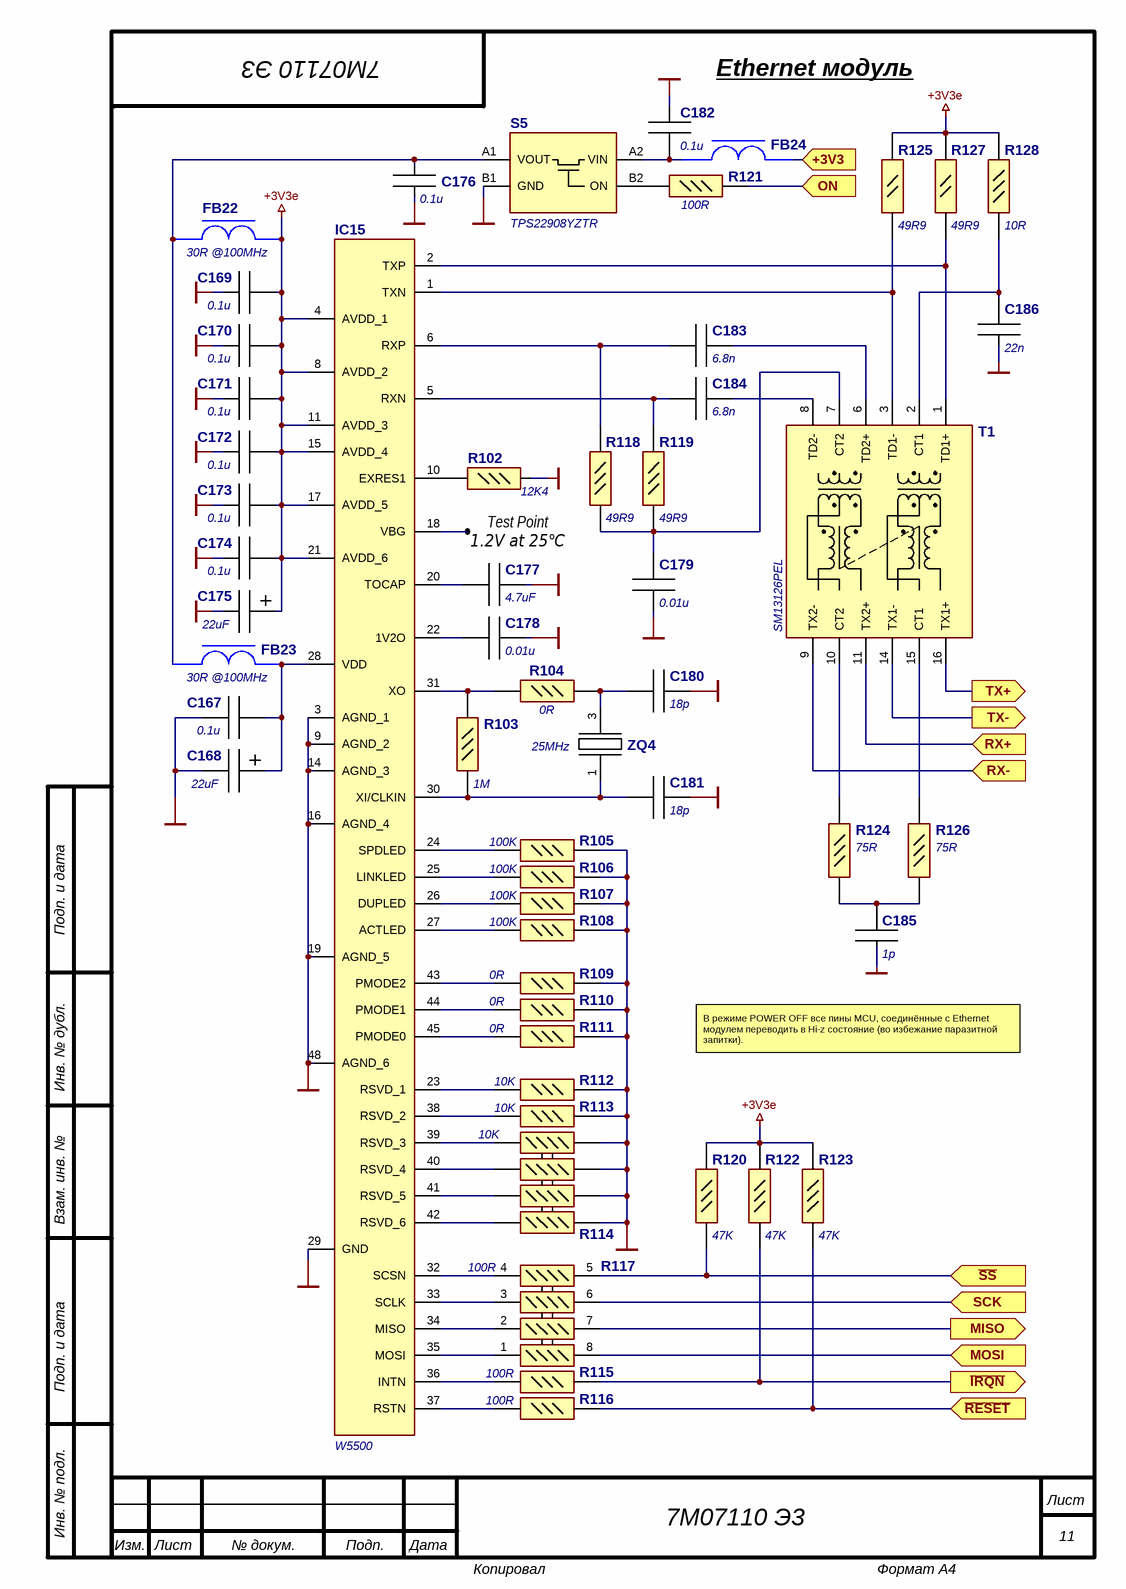
[diagram p4: Ethernet модуль.SchDoc]

### Parts
C167  0.1u  [:CAP0402 100x50x50]
C168  22uF  [:CAP1206 C3216-18]
C169  0.1u  [:CAP0402 100x50x50]
C170  0.1u  [:CAP0402 100x50x50]
C171  0.1u  [:CAP0402 100x50x50]
C172  0.1u  [:CAP0402 100x50x50]
C173  0.1u  [:CAP0402 100x50x50]
C174  0.1u  [:CAP0402 100x50x50]
C175  22uF  [:CAP1206 C3216-18]
C176  0.1u  [:CAP0402 100x50x50]
C177  4.7uF  [:CAP0805 C2012X125]
C178  0.01u  [:CAP0402 100x50x50]
C179  0.01u  [:CAP0402 100x50x50]
C180  18p  [:CAP0402 100x50x50]
C181  18p  [:CAP0402 100x50x50]
C182  0.1u  [:CAP0402 100x50x50]
C183  6.8n  [:CAP0402 100x50x50]
C184  6.8n  [:CAP0402 100x50x50]
C185  1p  [:CAP0402 100x50x50]
C186  22n  [:CAP0402 100x50x50]
FB22  30R @100MHz  [:FER BLM18SP300SN1D]
FB23  30R @100MHz  [:FER BLM18SP300SN1D]
FB24  30R @100MHz  [:FER BLM18SP300SN1D]  (value not drawn)
IC15  W5500  [:QFP48 P900X900X160-48N]
R102  Manufacturer_Part_Number (part 2: value): 12K4  [:RES0402]  (hidden comment: RC0402FR-07)
R103  Manufacturer_Part_Number (part 2: value): 1M  [:RES0402]  (hidden comment: RC0402FR-07)
R104  Manufacturer_Part_Number (part 2: value): 0R  [:RES0402]  (hidden comment: RC0402FR-07)
R105  Manufacturer_Part_Number (part 2: value): 100K  [:RES0402]  (hidden comment: RC0402FR-07)
R106  Manufacturer_Part_Number (part 2: value): 100K  [:RES0402]  (hidden comment: RC0402FR-07)
R107  Manufacturer_Part_Number (part 2: value): 100K  [:RES0402]  (hidden comment: RC0402FR-07)
R108  Manufacturer_Part_Number (part 2: value): 100K  [:RES0402]  (hidden comment: RC0402FR-07)
R109  Manufacturer_Part_Number (part 2: value): 0R  [:RES0402]  (hidden comment: RC0402FR-07)
R110  Manufacturer_Part_Number (part 2: value): 0R  [:RES0402]  (hidden comment: RC0402FR-07)
R111  Manufacturer_Part_Number (part 2: value): 0R  [:RES0402]  (hidden comment: RC0402FR-07)
R112  Manufacturer_Part_Number (part 2: value): 10K  [:RES0402]  (hidden comment: RC0402FR-07)
R113  Manufacturer_Part_Number (part 2: value): 10K  [:RES0402]  (hidden comment: RC0402FR-07)
R114  10K  [:RES0402x4]
R115  Manufacturer_Part_Number (part 2: value): 100R  [:RES0402]  (hidden comment: RC0402FR-07)
R116  Manufacturer_Part_Number (part 2: value): 100R  [:RES0402]  (hidden comment: RC0402FR-07)
R117  100R  [:RES0402x4]
R118  Manufacturer_Part_Number (part 2: value): 49R9  [:RES0402]  (hidden comment: RC0402FR-07)
R119  Manufacturer_Part_Number (part 2: value): 49R9  [:RES0402]  (hidden comment: RC0402FR-07)
R120  Manufacturer_Part_Number (part 2: value): 47K  [:RES0402]  (hidden comment: RC0402FR-07)
R121  Manufacturer_Part_Number (part 2: value): 100R  [:RES0402]  (hidden comment: RC0402FR-07)
R122  Manufacturer_Part_Number (part 2: value): 47K  [:RES0402]  (hidden comment: RC0402FR-07)
R123  Manufacturer_Part_Number (part 2: value): 47K  [:RES0402]  (hidden comment: RC0402FR-07)
R124  Manufacturer_Part_Number (part 2: value): 75R  [:RES0402]  (hidden comment: RC0402FR-07)
R125  49R9  [:RES0805]
R126  Manufacturer_Part_Number (part 2: value): 75R  [:RES0402]  (hidden comment: RC0402FR-07)
R127  49R9  [:RES0805]
R128  Manufacturer_Part_Number (part 2: value): 10R  [:RES0402]  (hidden comment: RC0402FR-07)
S5  TPS22908YZTR  [:BGA4 P90X90X50]
T1  SM13126PEL  [:TRAN SM13126PEL]
X3  Big Circle Pad  (value not drawn)
ZQ4  25MHz  [:RESO SXT22418FB48-25.000MT]

### Ports
+3V3 (in), MISO (out), MOSI (in), ON (in), RX+ (in), RX- (in), SCK (in), TX+ (out), TX- (out), ~{IRQN} (out), ~{RESET} (in), ~{SS} (in)

### Nets
+3V3: FB24.2 ; port +3V3
+3V3e: C169.2 C170.2 C171.2 C172.2 C173.2 C174.2 C175.1(+) FB22.2 IC15.4(AVDD_1) IC15.8(AVDD_2) IC15.11(AVDD_3) IC15.15(AVDD_4) IC15.17(AVDD_5) IC15.21(AVDD_6) R120.2 R122.2 R123.2 R125.2 R127.2 R128.2
GND: C167.1 C168.2 C169.1 C170.1 C171.1 C172.1 C173.1 C174.1 C175.2 C176.2 C177.2 C178.2 C179.1 C180.2 C181.2 C182.2 C185.2 C186.1 IC15.3(AGND_1) IC15.9(AGND_2) IC15.14(AGND_3) IC15.16(AGND_4) IC15.19(AGND_5) IC15.29(GND) IC15.48(AGND_6) R102.2 R105.2 R106.2 R107.2 R108.2 R109.2 R110.2 R111.2 R112.1 R113.1 R114.5 R114.6 R114.7 R114.8 S5.B1(GND)
RX+: T1.11(TX2+) ; port RX+
RX-: T1.9(TX2-) ; port RX-
TX+: T1.16(TX1+) ; port TX+
TX-: T1.14(TX1-) ; port TX-
NetC167_2: C167.2 C168.1(+) FB23.2 IC15.28(VDD)
NetC176_1: C176.1 FB22.1 FB23.1 S5.A1(VOUT)
NetC177_1: C177.1 IC15.20(TOCAP)
NetC178_1: C178.1 IC15.22(1V2O)
NetC179_2: C179.2 R118.1 R119.1 T1.7(CT2)
NetC180_1: C180.1 R104.2 ZQ4.3
NetC181_1: C181.1 IC15.30(XI/CLKIN) R103.1 ZQ4.1
NetC182_1: C182.1 FB24.1 S5.A2(VIN)
NetC183_1: C183.1 IC15.6(RXP) R118.2
NetC183_2: C183.2 T1.6(TD2+)
NetC184_1: C184.1 IC15.5(RXN) R119.2
NetC184_2: C184.2 T1.8(TD2-)
NetC185_1: C185.1 R124.2 R126.2
NetC186_2: C186.2 R128.1 T1.2(CT1)
NetIC7_A5: R117.7 ; port MISO
NetIC7_B4: R116.2 R123.1 ; port ~{RESET}
NetIC7_B5: R117.8 ; port MOSI
NetIC7_B7: R117.6 ; port SCK
NetIC7_E8: R121.2 ; port ON
NetIC7_E11: R115.2 R122.1 ; port ~{IRQN}
NetIC7_F6: R117.5 R120.1 ; port ~{SS}
NetIC15_1: IC15.1(TXN) R125.1 T1.3(TD1-)
NetIC15_2: IC15.2(TXP) R127.1 T1.1(TD1+)
NetIC15_10: IC15.10(EXRES1) R102.1
NetIC15_18: IC15.18(VBG) X3.1
NetIC15_23: IC15.23(RSVD_1) R112.2
NetIC15_24: IC15.24(SPDLED) R105.1
NetIC15_25: IC15.25(LINKLED) R106.1
NetIC15_26: IC15.26(DUPLED) R107.1
NetIC15_27: IC15.27(ACTLED) R108.1
NetIC15_31: IC15.31(XO) R103.2 R104.1
NetIC15_32: IC15.32(SCSN) R117.4
NetIC15_33: IC15.33(SCLK) R117.3
NetIC15_34: IC15.34(MISO) R117.2
NetIC15_35: IC15.35(MOSI) R117.1
NetIC15_36: IC15.36(INTN) R115.1
NetIC15_37: IC15.37(RSTN) R116.1
NetIC15_38: IC15.38(RSVD_2) R113.2
NetIC15_39: IC15.39(RSVD_3) R114.4
NetIC15_40: IC15.40(RSVD_4) R114.3
NetIC15_41: IC15.41(RSVD_5) R114.2
NetIC15_42: IC15.42(RSVD_6) R114.1
NetIC15_43: IC15.43(PMODE2) R109.1
NetIC15_44: IC15.44(PMODE1) R110.1
NetIC15_45: IC15.45(PMODE0) R111.1
NetR121_1: R121.1 S5.B2(ON)
NetR124_1: R124.1 T1.10(CT2)
NetR126_1: R126.1 T1.15(CT1)

### Notes on the sheet
- (near C182) Ethernet модуль
- (near X3) Test Point
  1.2V at 25℃
- В режиме POWER OFF все пины MCU, соединённые с Ethernet модулем переводить в Hi-z состояние (во избежание паразитной запитки).
- Подп. и дата
- Инв. № дубл.
- Взам. инв. №
- Инв. № подл.
- Лист
- Изм.
- № докум.
- Подп.
- Дата
- Копировал
- Формат А4

### Library data of the parts
C167 C169-C174 C176 C182 = GRM155R71E104KE14J: as C14 on sheet DC-DC модуль +3V3; Datasheet Link: http://www.murata.com/~/media/webrenewal/support/library/catalog/products/capacitor/mlcc/c02e.pdf; Height: 0.55mm; Manufacturer_Part_Number: GRM155R71E104KE14J; Mouser Part Number: 81-GRM155R71E104KE4J; Mouser Price/Stock: https://www.mouser.co.uk/ProductDetail/Murata-Electronics/GRM155R71E104KE14J?qs=hNud%2FORuBR2EQtvG2InwAQ%3D%3D; Arrow Part Number: GRM155R71E104KE14J; Arrow Price/Stock: https://www.arrow.com/en/products/grm155r71e104ke14j/murata-manufacturing
C168 C175 = TPSA226K006R0300: 22µF Molded Tantalum Capacitors 6.3V 1206 (3216 Metric) 300mOhm @ 100kHz; Manufacturer_Name: AVX; Short Description: 1206 22uF 6V3; Manufacturer_Part_Number: TPSA226K006R0300
C177 = GRM21BZ71E475KE15L: as C23 on sheet DC-DC модуль +14V; Datasheet Link: https://search.murata.co.jp/Ceramy/image/img/A01X/G101/ENG/GRM21BZ71E475KE15-01.pdf; Height: 1.45mm; Manufacturer_Part_Number: GRM21BZ71E475KE15L
C178 C179 = GRM1555CYA103JE01D: ±5% 35V Ceramic Capacitor C0G, NP0 0402 (1005 Metric); Manufacturer_Name: Murata Electronics; Short Description: 0402 0.01u 35V; Datasheet Link: https://search.murata.co.jp/Ceramy/image/img/A01X/G101/ENG/GRM1555CYA103JE01-01A.pdf; Height: 0.55mm; Manufacturer_Part_Number: GRM1555CYA103JE01D
C180 C181 = GJM1555C1H180JB01D: CAP CER  50V C0G/NP0 0402; Manufacturer_Name: Murata Electronics; Short Description: 0402 18p 50V; Manufacturer_Part_Number: GJM1555C1H180JB01D
C183 C184 = GCM155R71E682KA37D: CAP CER  25V X7R 0402; Manufacturer_Name: Murata Electronics; Short Description: 0402 6.8n 25V; Manufacturer_Part_Number: GCM155R71E682KA37D
C185 = GJM1555C1H1R0BB01D: CAP CER  50V C0G/NP0 0402; Manufacturer_Name: Murata Electronics; Short Description: 0402 1p 50V; Manufacturer_Part_Number: GJM1555C1H1R0BB01D
C186 = GCM155R71E223KA55D: CAP CER  25V X7R 0402; Manufacturer_Name: Murata Electronics; Short Description: 0402 22n 25V; Manufacturer_Part_Number: GCM155R71E223KA55D
FB22-FB24 = BLM18SP300SN1D: as FB1 on sheet 7М07110 Э3; Datasheet Link: http://www.murata.com/~/media/webrenewal/support/library/catalog/products/emc/emifil/c31e.ashx?la=en-gb; Height: 0.95mm; Manufacturer_Part_Number: BLM18SP300SN1D; Mouser Part Number: 81-BLM18SP300SN1D; Mouser Price/Stock: https://www.mouser.co.uk/ProductDetail/Murata-Electronics/BLM18SP300SN1D/?qs=W%2FMpXkg%252BdQ4o%252BOP%252B6m8FYA%3D%3D
IC15 = W5500: Ethernet ICs 3in1 Enet Controller TCP/IP +MAC+PHY; Manufacturer_Name: Wiznet Technology; Datasheet Link: https://www.arrow.com/en/products/w5500/wiznet; Height: 1.6mm; Manufacturer_Part_Number: W5500; Arrow Part Number: W5500; Arrow Price/Stock: https://www.arrow.com/en/products/w5500/wiznet
R102-R113 R115 R116 R118-R124 R126 R128 = RC0402FR-07: as R1 on sheet 7М07110 Э3; Datasheet Link: http://www.yageo.com/documents/recent/PYu-RC0402_51_RoHS_L_6_r.pdf; Height: 0.4mm; Manufacturer_Part_Number: RC0402FR-07; Parameter 1: *
R114 = EXB-N8V103JX: 10 kOhm ±5% 31mW Power Per Element Isolated 4 Resistor Network/Array ±200ppm/°C 0804, Concave, Long Side Terminals; Manufacturer_Name: Panasonic; Short Description: 0804 5% 10k; Datasheet Link: https://industrial.panasonic.com/cdbs/www-data/pdf/AOC0000/AOC0000C14.pdf; Height: 0.55mm; Manufacturer_Part_Number: EXB-N8V103JX
R117 = EXB-N8V101JX: 100 Ohm ±5% 31mW Power Per Element Isolated 4 Resistor Network/Array ±200ppm/°C 0804, Concave, Long Side Terminals; Manufacturer_Name: Panasonic; Short Description: 0804 5% 100R; Datasheet Link: https://industrial.panasonic.com/cdbs/www-data/pdf/AOC0000/AOC0000C14.pdf; Height: 0.55mm; Manufacturer_Part_Number: EXB-N8V101JX; Mouser Part Number: 667-EXB-N8V101JX; Mouser Price/Stock: https://www.mouser.co.uk/ProductDetail/Panasonic/EXB-N8V101JX?qs=cttFivMKqWxyXyoXALoehw%3D%3D; Arrow Part Number: EXB-N8V101JX; Arrow Price/Stock: https://www.arrow.com/en/products/exbn8v101jx/panasonic
R125 R127 = ERJ-6ENF49R9V: 49.9 Ohms ±1% 0.125W, 1/8W Chip Resistor 0805 (2012 Metric) Automotive AEC-Q200 Thick Film; Manufacturer_Name: Panasonic; Datasheet Link: https://industrial.panasonic.com/cdbs/www-data/pdf/RDA0000/AOA0000C84.pdf; Height: 0.7mm; Manufacturer_Part_Number: ERJ-6ENF49R9V; Mouser Part Number: 667-ERJ-6ENF49R9V; Mouser Price/Stock: https://www.mouser.co.uk/ProductDetail/Panasonic/ERJ-6ENF49R9V?qs=qCGL2%252BBFAqUwh1urNYOtNA%3D%3D; Arrow Part Number: ERJ-6ENF49R9V; Arrow Price/Stock: https://www.arrow.com/en/products/erj-6enf49r9v/panasonic
S5 = TPS22908YZTR: SPST Switch 3.6-V, 1-A, 28-mΩ; Manufacturer_Name: Texas Instruments; Datasheet Link: http://www.ti.com/lit/gpn/tps22908; Height: 0.625mm; Manufacturer_Part_Number: TPS22908YZTR; Mouser Part Number: 595-TPS22908YZTR; Mouser Price/Stock: https://www.mouser.co.uk/ProductDetail/Texas-Instruments/TPS22908YZTR?qs=4whTb%2F0XQMjgQyC%252BYmbgaA%3D%3D; Arrow Part Number: TPS22908YZTR; Arrow Price/Stock: https://www.arrow.com/en/products/tps22908yztr/texas-instruments
T1 = SM13126PEL: Transformers LAN 10/100 BASE-T; Manufacturer_Name: Bourns; Datasheet Link: https://componentsearchengine.com/Datasheets/1/SM13126PEL.pdf; Height: 6.15mm; Manufacturer_Part_Number: SM13126PEL; Mouser Part Number: 652-SM13126PEL; Mouser Price/Stock: https://www.mouser.co.uk/ProductDetail/Bourns/SM13126PEL?qs=T3oQrply3y%252BgoqE984ONrg%3D%3D; Arrow Part Number: SM13126PEL; Arrow Price/Stock: https://www.arrow.com/en/products/sm13126pel/bourns
X3 = Big Circle Pad: Большая круглая контактная площадка
ZQ4 = SXT22418FB48-25.000MT: CRYSTAL 25MHz / ±10ppm Crystal 18pF 4-SMD / ESR: 80 Ohms; Manufacturer_Name: Suntsu Electronics, Inc.; Manufacturer_Part_Number: SXT22418FB48-25.000MT; Short Description: 25MHz